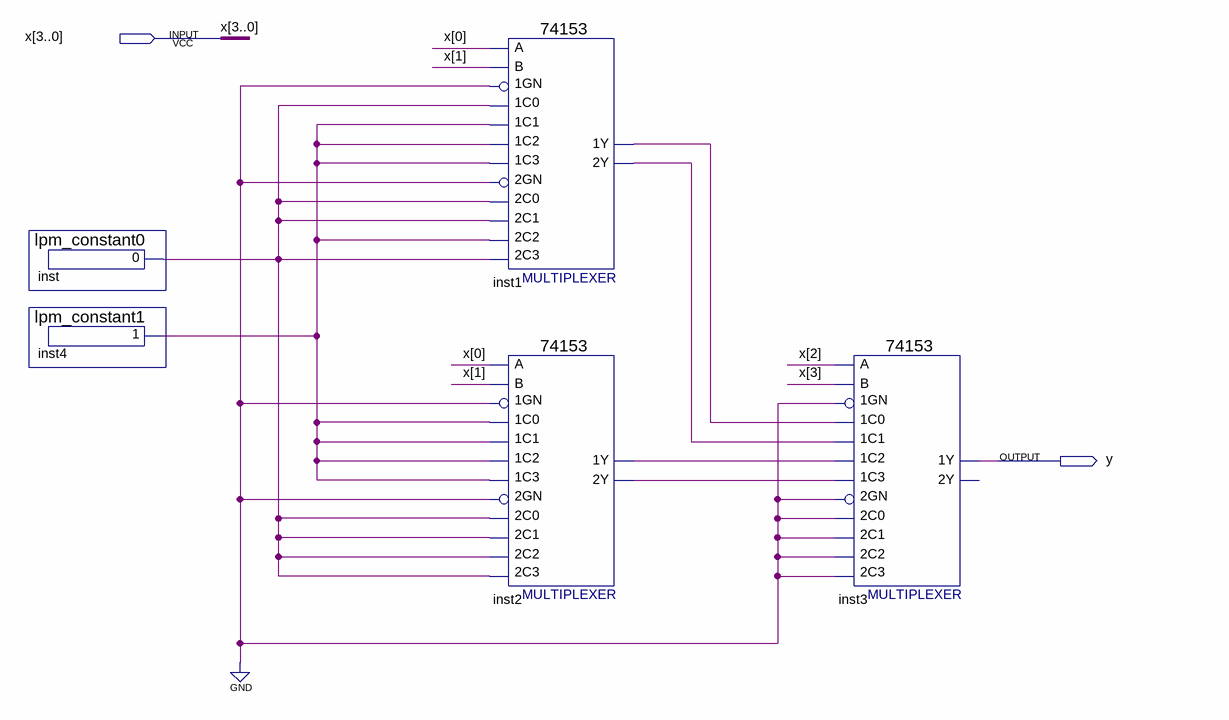
[diagram p0: schematic sheet]
// Quartus schematic Pract2.bdf as structural Verilog: 5 symbols, 2 pins
module Pract2 (
  input  [3:0] x,
  output y
);

  wire inst1_1y, inst1_2y, inst2_1y, inst2_2y, inst4_result, inst_result;

  lpm_constant0 inst (.result(inst_result));
  lpm_constant1 inst4 (.result(inst4_result));
  \74153  inst1 (
    .\1C1 (inst4_result), .\1GN (1'b0), .\1C0 (inst_result), .\2C0 (inst_result), .\2GN (1'b0),
    .\2C2 (inst4_result), .\1C2 (inst4_result), .\1C3 (inst4_result), .B(x[1]), .A(x[0]),
    .\2C1 (inst_result), .\2C3 (inst_result), .\1Y (inst1_1y), .\2Y (inst1_2y));
  \74153  inst2 (
    .\1C1 (inst4_result), .\1GN (1'b0), .\1C0 (inst4_result), .\2C0 (inst_result), .\2GN (1'b0),
    .\2C2 (inst_result), .\1C2 (inst4_result), .\1C3 (inst4_result), .B(x[1]), .A(x[0]), .\2C1 (inst_result),
    .\2C3 (inst_result), .\1Y (inst2_1y), .\2Y (inst2_2y));
  \74153  inst3 (
    .\1C1 (inst1_2y), .\1GN (1'b0), .\1C0 (inst1_1y), .\2C0 (1'b0), .\2GN (1'b0), .\2C2 (1'b0),
    .\1C2 (inst2_1y), .\1C3 (inst2_2y), .B(x[3]), .A(x[2]), .\2C1 (1'b0), .\2C3 (1'b0), .\1Y (y));  // open: 2Y
endmodule
